# Altium schematic sheet Controller.SchDoc
size C; SheetNumber: 2; SheetTotal: 2
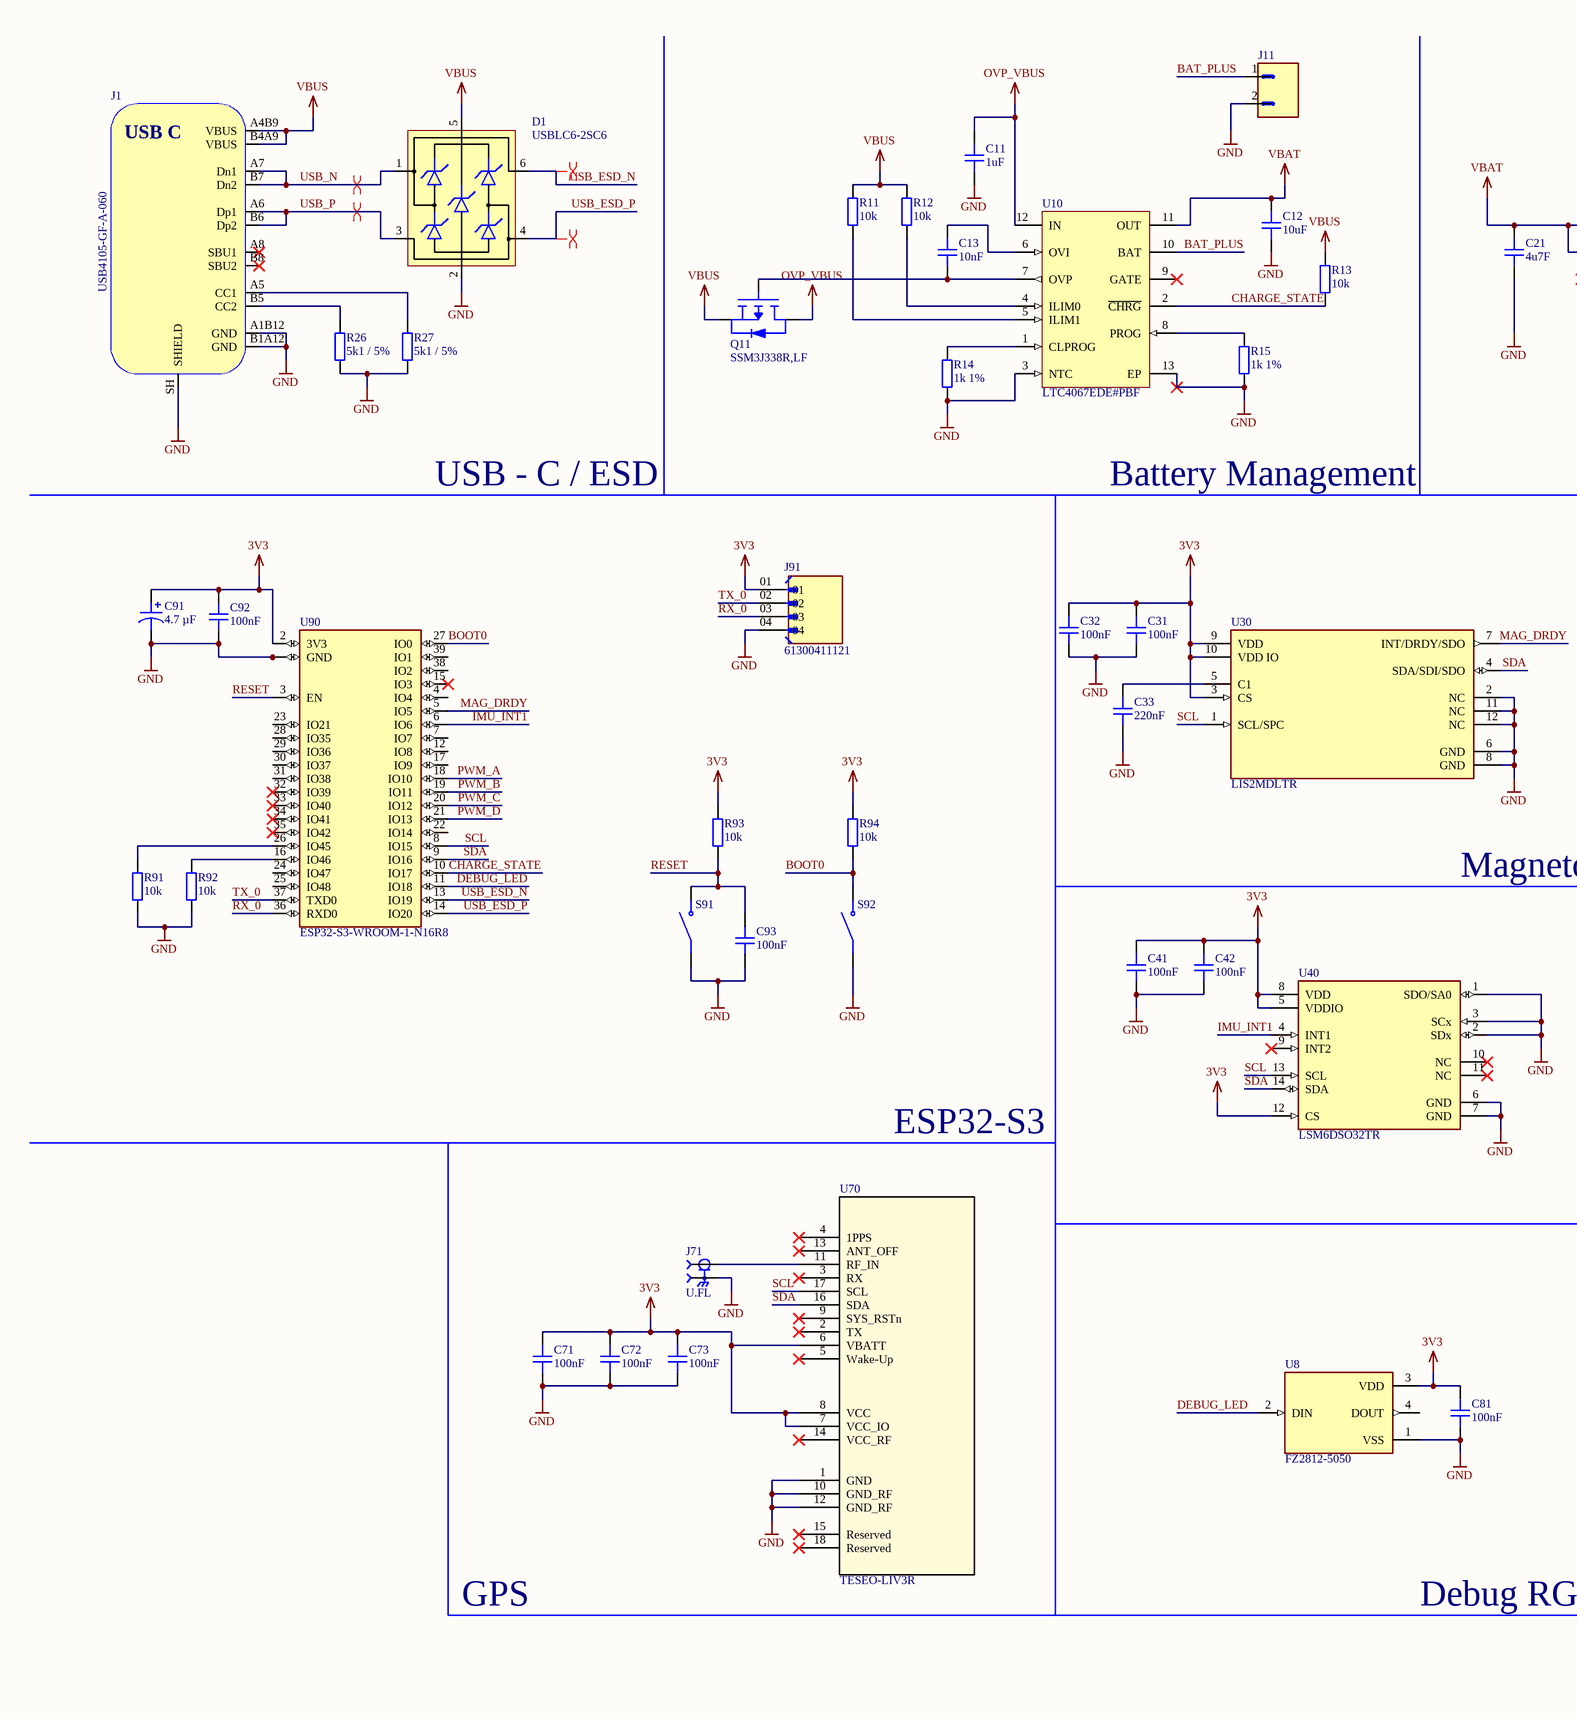
[diagram p0: Controller.SchDoc, left]
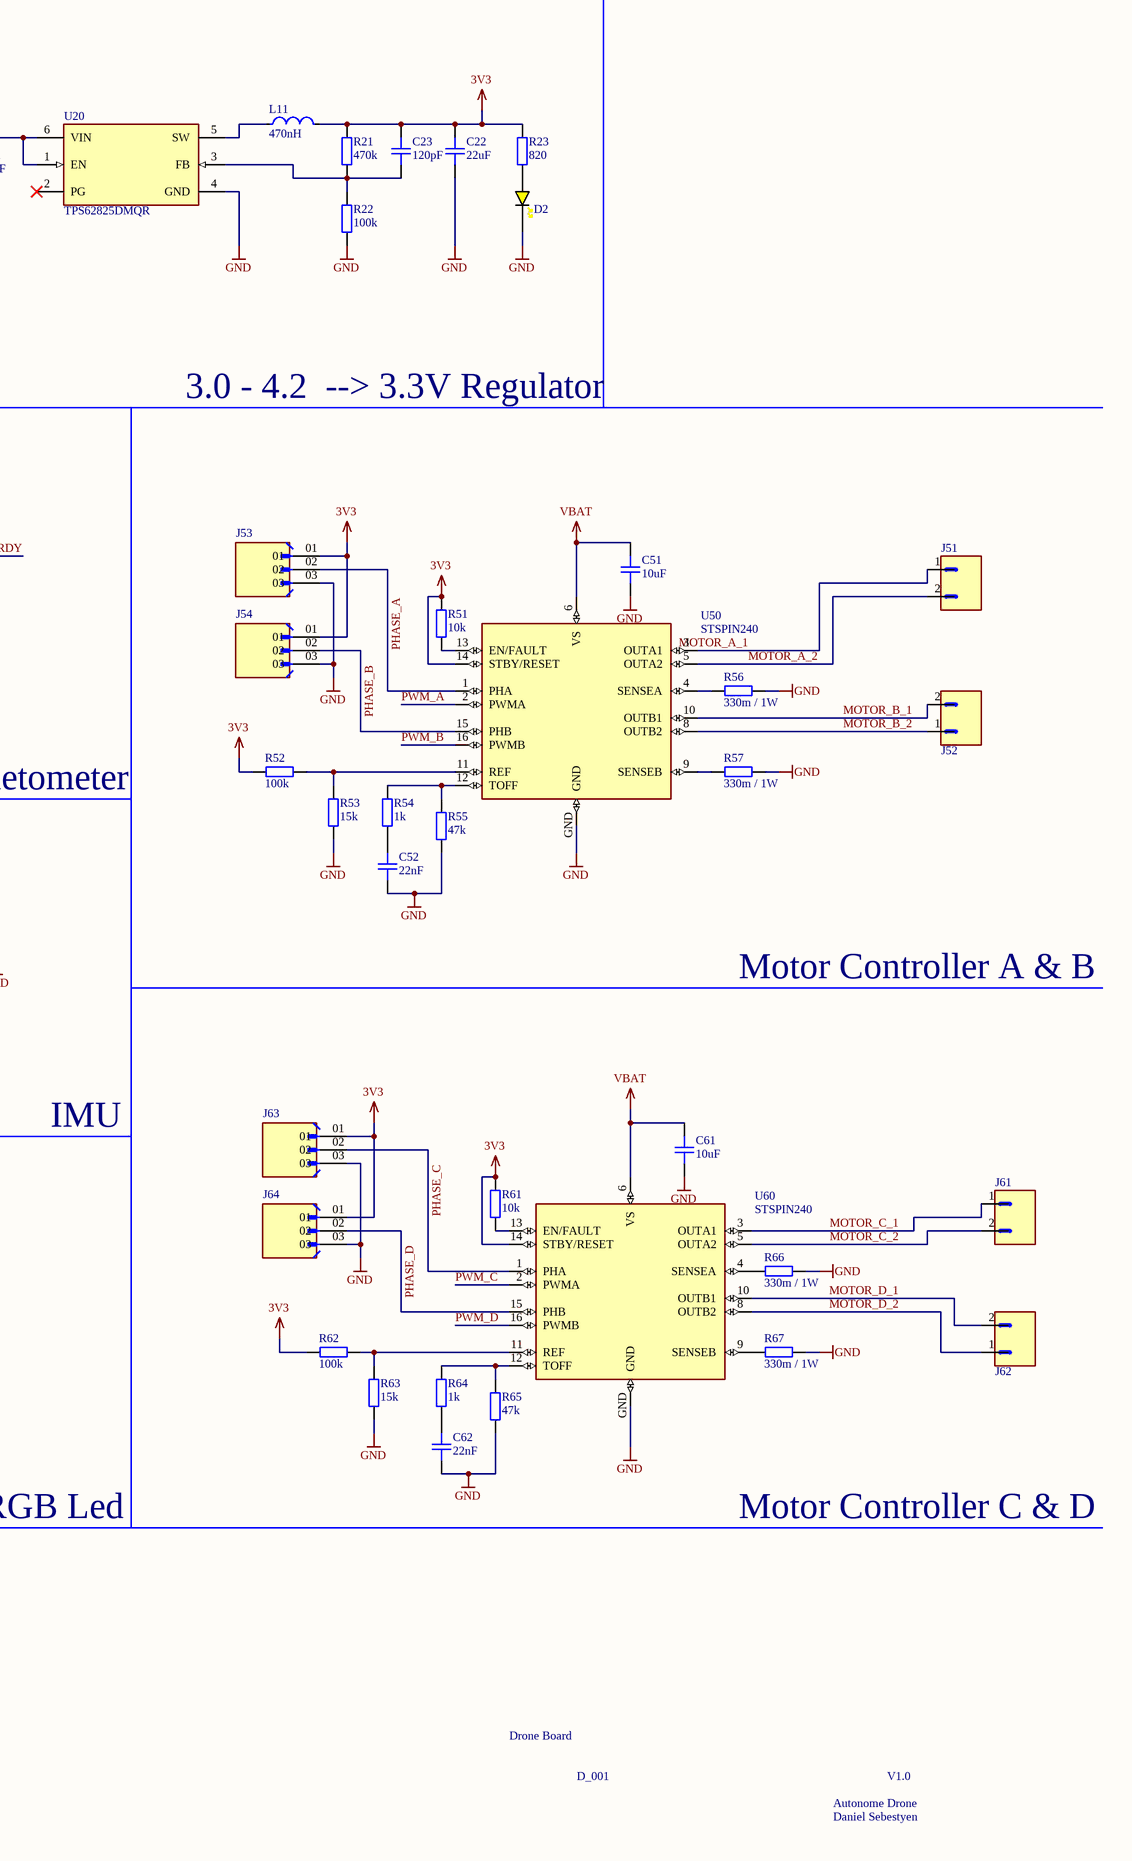
[diagram p1: Controller.SchDoc, right]

## Parts
C11  1uF  [CAP_0201]
C12  10uF  [CAP_0201]
C13  10nF  [CAP_0201]
C21  4u7F  [CAP_0402]
C22  22uF  [CAP_0402]
C23  120pF  [CAP_0402]
C31  100nF  [CAP_0201]
C32  100nF  [CAP_0201]
C33  220nF  [CAP_0201]
C41  100nF  [CAP_0201]
C42  100nF  [CAP_0201]
C51  10uF  [CAP_0201]
C52  22nF  [CAP_0201]
C61  10uF  [CAP_0201]
C62  22nF  [CAP_0201]
C71  100nF  [CAP_0201]
C72  100nF  [CAP_0201]
C73  100nF  [CAP_0201]
C81  100nF  [CAP_0201]
C91  4.7 µF  [CAP ALSMD 4.3MM H5.4MM]
C92  100nF  [CAP_0201]
C93  100nF  [CAP_0201]
D1  USBLC6-2SC6  [SOT-23-6]
D2  1.8V  [LED_0402_YELLOW]  (value not drawn)
J1  USB4105-GF-A-060  [USB4105-GF-A-060]
J11  S2B-PH-SM4-TB(LF)(SN)  [S2B-PH-SM4-TB(LF)(SN)]  (value not drawn)
J51  S2B-PH-SM4-TB(LF)(SN)  [S2B-PH-SM4-TB(LF)(SN)]  (value not drawn)
J52  S2B-PH-SM4-TB(LF)(SN)  [S2B-PH-SM4-TB(LF)(SN)]  (value not drawn)
J53  61300311121  [WURTH_61300311121]  (value not drawn)
J54  61300311121  [WURTH_61300311121]  (value not drawn)
J61  S2B-PH-SM4-TB(LF)(SN)  [S2B-PH-SM4-TB(LF)(SN)]  (value not drawn)
J62  S2B-PH-SM4-TB(LF)(SN)  [S2B-PH-SM4-TB(LF)(SN)]  (value not drawn)
J63  61300311121  [WURTH_61300311121]  (value not drawn)
J64  61300311121  [WURTH_61300311121]  (value not drawn)
J71  U.FL  [MOLEX_73412-0114]
J91  61300411121  [WURTH_61300411121]
L11  470nH  [FP-DFE201610C-MFG]
Q11  SSM3J338R,LF  [SSM3J338R,LF-SOT23-F]
R11  10k  [RES_0201]
R12  10k  [RES_0201]
R13  10k  [RES_0201]
R14  1k 1%  [RES_0201]
R15  1k 1%  [RES_0201]
R21  470k  [RES_0402]
R22  100k  [RES_0402]
R23  820  [RES_0402]
R26  5k1 / 5%  [RES_0201]
R27  5k1 / 5%  [RES_0201]
R51  10k  [RES_0201]
R52  100k  [RES_0201]
R53  15k  [RES_0201]
R54  1k  [RES_0201]
R55  47k  [RES_0201]
R56  330m / 1W  [RES_0201]
R57  330m / 1W  [RES_0201]
R61  10k  [RES_0201]
R62  100k  [RES_0201]
R63  15k  [RES_0201]
R64  1k  [RES_0201]
R65  47k  [RES_0201]
R66  330m / 1W  [RES_0201]
R67  330m / 1W  [RES_0201]
R91  10k  [RES_0201]
R92  10k  [RES_0201]
R93  10k  [RES_0201]
R94  10k  [RES_0201]
S91  PTS636_SM43J_SMTR_LFS  [SW_PTS636_SM43J_SMTR_LFS]  (value not drawn)
S92  PTS636_SM43J_SMTR_LFS  [SW_PTS636_SM43J_SMTR_LFS]  (value not drawn)
U8  FZ2812-5050  [LED_FZ2812-5050]
U10  LTC4067EDE#PBF  [LT-DE-UE-12_V]
U20  TPS62825DMQR  [FP-DMQ0006A-MFG]
U30  LIS2MDLTR  [FP-LGA-12-DM00170568-MFG]
U40  LSM6DSO32TR  [FP-LGA-14L-DM00249496-MFG]
U50  STSPIN240  [VFQFPN_3X3X1MM]
U60  STSPIN240  [VFQFPN_3X3X1MM]
U70  TESEO-LIV3R  [ARRAY_LIV3R_STM]
U90  ESP32-S3-WROOM-1-N16R8  [ESP32S3WROOM1N8R2]

## Nets
3V3: C22.2 C23.2 C31.2 C32.2 C41.2 C42.2 C71.2 C72.2 C73.2 C81.2 C91.1 C92.2 J53.01 J54.01 J63.01 J64.01 J91.01 L11.2 R21.2 R23.2 R51.1 R52.2 R61.1 R62.2 R93.2 R94.2 U8.3(VDD) U30.3(CS) U30.9(VDD) U30.10(VDD_IO) U40.5(VDDIO) U40.8(VDD) U40.12(CS) U50.14(STBY/RESET) U60.14(STBY/RESET) U70.6(VBATT) U70.7(VCC_IO) U70.8(VCC) U90.2(3V3)
GND: C11.1 C12.1 C21.1 C22.1 C31.1 C32.1 C33.1 C41.1 C42.1 C51.1 C52.1 C61.1 C62.1 C71.1 C72.1 C73.1 C81.1 C91.2 C92.1 C93.1 D1.2(GND) D2.K J1.A1B12(GND) J1.B1A12(GND) J1.SH(SHIELD) J11.2 J53.03 J54.03 J63.03 J64.03 J71.GND J91.04 R14.1 R15.1 R22.1 R26.1 R27.1 R53.2 R55.2 R56.1 R57.1 R63.2 R65.2 R66.1 R67.1 R91.1 R92.1 S91.1(COM) S92.1(COM) U8.1(VSS) U10.3(NTC) U10.13(EP) U20.4(GND) U30.2(NC) U30.6(GND) U30.8(GND) U30.11(NC) U30.12(NC) U40.1(SDO/SA0) U40.2(SDx) U40.3(SCx) U40.6(GND) U40.7(GND) U50.GND U60.GND U70.1(GND) U70.10(GND_RF) U70.12(GND_RF) U90.1(GND) U90.40(GND) U90.41(GND) U90.42(GND) U90.43(GND) U90.44(GND) U90.45(GND) U90.46(GND) U90.47(GND) U90.48(GND) U90.49(GND)
OVP_VBUS: C11.2 Q11.D U10.12(IN)
VBAT: C12.2 C21.2 C51.2 C61.2 U10.11(OUT) U20.1(EN) U20.6(VIN) U50.6(VS) U60.6(VS)
VBUS: D1.5(VBUS) J1.A4B9(VBUS) J1.B4A9(VBUS) Q11.S R11.2 R12.2 R13.2
BAT_PLUS: J11.1 U10.10(BAT)
BOOT0: R94.1 S92.2(NO) U90.27(IO0)
CHARGE_STATE: R13.1 U10.2(~{CHRG}) U90.10(IO17)
DEBUG_LED: U8.2(DIN) U90.11(IO18)
IMU_INT1: U40.4(INT1) U90.6(IO6)
MAG_DRDY: U30.7(INT/DRDY/SDO) U90.5(IO5)
MOTOR_A_1: J51.1 U50.3(OUTA1)
MOTOR_A_2: J51.2 U50.5(OUTA2)
MOTOR_B_1: J52.2 U50.10(OUTB1)
MOTOR_B_2: J52.1 U50.8(OUTB2)
MOTOR_C_1: J61.1 U60.3(OUTA1)
MOTOR_C_2: J61.2 U60.5(OUTA2)
MOTOR_D_1: J62.2 U60.10(OUTB1)
MOTOR_D_2: J62.1 U60.8(OUTB2)
PHASE_A: J53.02 U50.1(PHA)
PHASE_B: J54.02 U50.15(PHB)
PHASE_C: J63.02 U60.1(PHA)
PHASE_D: J64.02 U60.15(PHB)
PWM_A: U50.2(PWMA) U90.18(IO10)
PWM_B: U50.16(PWMB) U90.19(IO11)
PWM_C: U60.2(PWMA) U90.20(IO12)
PWM_D: U60.16(PWMB) U90.21(IO13)
RESET: C93.2 R93.1 S91.2(NO) U90.3(EN)
RX_0: J91.03 U90.36(RXD0)
SCL: U30.1(SCL/SPC) U40.13(SCL) U70.17(SCL) U90.8(IO15)
SDA: U30.4(SDA/SDI/SDO) U40.14(SDA) U70.16(SDA) U90.9(IO16)
TX_0: J91.02 U90.37(TXD0)
USB_ESD_N: D1.6(IO1) U90.13(IO19)
USB_ESD_P: D1.4(IO2) U90.14(IO20)
USB_N: D1.1(IO1) J1.A7(Dn1) J1.B7(Dn2)
USB_P: D1.3(IO2) J1.A6(Dp1) J1.B6(Dp2)
NetC13_1: C13.1 Q11.G U10.7(OVP)
NetC13_2: C13.2 U10.6(OVI)
NetC23_1: C23.1 R21.1 R22.2 U20.3(FB)
NetC33_2: C33.2 U30.5(C1)
NetC52_2: C52.2 R54.2
NetC62_2: C62.2 R64.2
NetD2_A: D2.A R23.1
NetJ1_A5: J1.A5(CC1) R27.2
NetJ1_B5: J1.B5(CC2) R26.2
NetJ71_1: J71.1(SIG) U70.11(RF_IN)
NetL11_1: L11.1 U20.5(SW)
NetR11_1: R11.1 U10.5(ILIM1)
NetR12_1: R12.1 U10.4(ILIM0)
NetR14_2: R14.2 U10.1(CLPROG)
NetR15_2: R15.2 U10.8(PROG)
NetR51_2: R51.2 U50.13(EN/FAULT)
NetR52_1: R52.1 R53.1 U50.11(REF)
NetR54_1: R54.1 R55.1 U50.12(TOFF)
NetR56_2: R56.2 U50.4(SENSEA)
NetR57_2: R57.2 U50.9(SENSEB)
NetR61_2: R61.2 U60.13(EN/FAULT)
NetR62_1: R62.1 R63.1 U60.11(REF)
NetR64_1: R64.1 R65.1 U60.12(TOFF)
NetR66_2: R66.2 U60.4(SENSEA)
NetR67_2: R67.2 U60.9(SENSEB)
NetR91_2: R91.2 U90.26(IO45)
NetR92_2: R92.2 U90.16(IO46)

Not connected (* = marked no-connect by the designer): J1 A8(SBU1)* B8(SBU2)*; U8 4(DOUT); U10 9(GATE)*; U20 2(PG)*; U40 9(INT2)* 10(NC)* 11(NC)*; U70 2(TX)* 3(RX)* 4(1PPS)* 5(Wake-Up)* 9(SYS_RSTn)* 13(ANT_OFF)* 14(VCC_RF)* 15(Reserved)* 18(Reserved)*; U90 4(IO4) 7(IO7) 12(IO8) 15(IO3)* 17(IO9) 22(IO14) 23(IO21) 24(IO47) 25(IO48) 28(IO35) 29(IO36) 30(IO37) 31(IO38) 32(IO39)* 33(IO40)* 34(IO41)* 35(IO42)* 38(IO2) 39(IO1)

## Layout directives
differential pair: USB_ESD_N, USB_ESD_P, USB_N, USB_P

## Notes on the sheet
- USB - C / ESD
- Battery Management
- 3.0 - 4.2  --> 3.3V Regulator
- Magnetometer
- Motor Controller A & B
- ESP32-S3
- IMU
- GPS
- Debug RGB Led
- Motor Controller C & D
- Drone Board
- D_001
- Daniel Sebestyen
- Autonome Drone
- V1.0
- (in symbol USB4105-GF-A-060) USB C

## Library data of the parts
C11-C13 C31-C33 C41 C42 C51 C52 C61 C62 C71-C73 C81 C92 C93 = CAP_0402: Capacitor SMD 0402; Manufacturer: *; Manufacturer Part Number: *; Distributor Link: *; LCSC: *; Rating: *; Dielectric: *
C21-C23 = CAP_0603: Capacitor SMD 0603; Manufacturer: *; Manufacturer Part Number: *; Distributor Link: *; LCSC: *; Rating: *; Dielectric: *
C91 = EEE-1CA4R7NR: CAP ALUM 4.7UF 20% 16V SMD; manufacturer: Panasonic Electronic Components; Lifetime @ Temp.: 2000 Hrs @ 85°C; Polarization: Polar; Ripple Current @ High Frequency: 34 mA @ 10 kHz; Ripple Current @ Low Frequency: 20 mA @ 120 Hz; Surface Mount Land Size: 0.169" L x 0.169" W (4.30mm x 4.30mm); Part Number: EEE-1CA4R7NR; Applications: Automotive; Capacitance: 4.7 µF; componentlink1description: Datasheet; componentlink1url: //media.digikey.com/pdf/Data%20Sheets/Panasonic%20Electronic%20Components/S_Series,Type_V_Rev2018.pdf; componentlink2description: DigiKey Link; componentlink2url: https://www.digikey.com/en/products/detail/panasonic-electronic-components/EEE-1CA4R7NR/946205; Device Package: Radial, Can - SMD; Height - Seated (Max): 0.217" (5.50mm); lastupdated: 6/3/2024 19:52:58; Lifecycle Status: Active; Minimum Order: 1; Mounting Type: Surface Mount; Operating Temperature: -40°C ~ 85°C; Package / Case: Radial, Can - SMD; packaging: TapeAndReel; partid: 7087; Part Status: Active; price: 0.07; Ratings: AEC-Q200; series: S; Size / Dimension: 0.157" Dia (4.00mm); Supplier 1: DigiKey; Supplier Part Number 1: PCE4290CT-ND; Tolerance: ±20%; value: 4.7 µF; Voltage - Rated: 16 V
D1 = USBLC6-2SC6: Low-Capacitance ESD Protection USB; Manufacturer: STMicroelectronics; Manufacturer Part Number: USBLC6-2SC6; Distributor Link: https://www.mouser.de/ProductDetail/STMicroelectronics/USBLC6-2SC6?qs=po45yt2pPpu%2FhNIlwQdTlg%3D%3D
D2 = LED_0603_YELLOW: LED 0603 YELLOW SMD
J1 = USB4105-GF-A-060: USB Connector Type C SMT 12 Pin; Manufacturer: GCT; Manufacturer Part Number: USB4105-GF-A-060; Distributor Link: https://eu.mouser.com/ProductDetail/GCT/USB4105-GF-A-060?qs=QNEnbhJQKvY2mocwNJzgfA%3D%3D
J11 J51 J52 J61 J62 = S2B-PH-SM4-TB(LF)(SN): Connector Header Surface Mount, Right Angle 2 position 0.079 (2.00mm); MF: JST Sales; SnapEDA_Link: https://www.snapeda.com/parts/S2B-PH-SM4-TB(LF)(SN)/JST+Sales+America+Inc./view-part/?ref=snap; Package: None; Value: *; MP: S2B-PH-SM4-TB(LF)(SN); Check_prices: https://www.snapeda.com/parts/S2B-PH-SM4-TB(LF)(SN)/JST+Sales+America+Inc./view-part/?ref=eda
J53 J54 J63 J64 = 61300311121: Connector Header Through Hole 3 position 0.100 (2.54mm); MF: Wurth Electronics; SnapEDA_Link: https://www.snapeda.com/parts/61300311121/Wurth+Electronics/view-part/?ref=snap; Package: None; Value: *; MP: 61300311121; Check_prices: https://www.snapeda.com/parts/61300311121/Wurth+Electronics/view-part/?ref=eda
J71 = 73412-0114: Female Surface Mount Coaxial Socket, Solder Termination | Molex Incorporated 73412-0114; SnapEDA_Link: https://www.snapeda.com/parts/73412-0114/Molex/view-part/?ref=snap; Package: None; Value: *; MF: Molex; MP: 73412-0114; Check_prices: https://www.snapeda.com/parts/73412-0114/Molex/view-part/?ref=eda
J91 = 61300411121: 4 pins, 1 row, straight, gold plating; MF: Wurth Electronics; SnapEDA_Link: https://www.snapeda.com/parts/61300411121/Wurth+Electronics/view-part/?ref=snap; Package: None; Value: *; MP: 61300411121; Check_prices: https://www.snapeda.com/parts/61300411121/Wurth+Electronics/view-part/?ref=eda
L11 = CMP-06042-011901-1: Shielded Wirewound Inductor 0.47uH 20% 3600mA 0.032Ω 0806 (2016)
Q11 = SSM3J338R,LF: MOSFET P-Channel Vds=12V Id=6A; Manufacturer Part Number: Toshiba; Manufacturer: SSM3J338R,LF
R11-R15 R26 R27 R51-R57 R61-R67 R91-R94 = RES_0402: Resistor SMD 0402; Manufacturer: *; Manufacturer Part Number: *; Distributor Link: *; LCSC: *
R21-R23 = RES_0603: Resistor SMD 0603; Manufacturer: *; Manufacturer Part Number: *; Distributor Link: *; LCSC: *
S91 S92 = PTS636_SM43J_SMTR_LFS: Tactile Switch SPST-NO Top Actuated Surface Mount; MF: C&K; MP: PTS636 SM43J SMTR LFS; SnapEDA_Link: https://www.snapeda.com/parts/PTS636%20SM43J%20SMTR%20LFS/C%2526K/view-part/?ref=snap; Package: None; Value: *; Check_prices: https://www.snapeda.com/parts/PTS636%20SM43J%20SMTR%20LFS/C%2526K/view-part/?ref=eda
U8 = FZ2812-5050: Addressable Lighting * 3 LED Discrete Serial Red, Green, Blue (RGB) 5.00mm L x 5.00mm W; MF: Feztek; Package: None; Price: None; Check_prices: https://www.snapeda.com/parts/FZ2812-5050/E%2526E/view-part/?ref=eda; Value: *; SnapEDA_Link: https://www.snapeda.com/parts/FZ2812-5050/E%2526E/view-part/?ref=snap; MP: FZ2812-5050; Availability: In Stock; Purchase-URL: https://pricing.snapeda.com/search?q=FZ2812-5050&ref=eda
U10 = CMP-0478-00072-1: USB Power Manager with OVP and Li-Ion / Polymer Charger, 4.35 to 5.5 V Vin, 12-pin SON (DE-UE-12), -40 to 85 degC, Pb-Free; Manufacturer: Linear Technology; Number of Cells: 1; PartNumber: LTC4067EDE#PBF; ComponentLink3Description: Package Specification; ComponentLink1Description: Manufacturer URL; Mounting Technology: Surface Mount; Code_JEDEC: MO-229; PackageDescription: 12-Pin Plastic DFN, Body 4 x 3 mm, Pitch 0.5 mm; RoHS: TRUE; Number of Outputs: 1; ComponentLink2Description: Datasheet; ComponentLink1URL: http://www.linear.com/; ComponentLink3URL: http://cds.linear.com/docs/en/packaging/DFN_12_05-08-1695.pdf; PackageReference: DE-UE-12; PackageVersion: Rev. D, 06/2010; ComponentLink2URL: http://cds.linear.com/docs/en/datasheet/4067f.pdf
U20 = CMP-04918-000438-1: IC REG BUCK ADJUSTABLE 2A 6VSON; Max Input Voltage: 5.5V; Number of Outputs: 1; Min Output Voltage: 600mV; Switching Frequency: 2.2MHz; Synchronous Rectifier: Yes; Max Output Voltage: 4V; Min Input Voltage: 2.4V; Output Configuration: Positive; Max Operating Temperature: 125°C; Output Type: Adjustable; Output Current: 2A; Mount: Surface Mount; Min Operating Temperature: -40°C; Number of Pins: 6; RoHS Compliant: Yes; Packaging: Tape and Reel
U30 = CMP-12173-000002-1: SENSOR MR I2C/SPI 12LGA; Manufacturer: STMicroelectronics; Sensing Method: Magnetic; Min Supply Voltage: 1.71V; Sensor Output: I2C,SPI; Operating Supply Current: 50-200uA; Max Supply Voltage: 3.6V; Octopart: https://octopart.com/lis2mdltr-stmicroelectronics-81117311; RoHS: TRUE; Device Class L3: unset; Device Class L1: Sensors; ComponentLink2URL: https://www.st.com/resource/en/datasheet/lis2mdl.pdf; Automotive: No; Device Class L2: Magnetic Sensors; Lead Free: Yes; Temperature: -40°C to +85°C; Manufacturer Part Number: LIS2MDLTR; Temperature Range High: +85°C; Height: 0.7mm; Digikey Description: SENSOR MR I2C/SPI 12LGA; Category: IC; ComponentLink2Description: Datasheet; Package: LGA-12-DM00170568; Temperature Range Low: -40°C
U40 = CMP-12177-000015-1: INEMO INERTIAL MODULE: 3D ACCELE
U50 U60 = STSPIN240: Half Bridge (4) Driver DC Motors, General Purpose Power MOSFET 16-VFQFPN (3x3); MF: STMicroelectronics; SnapEDA_Link: https://www.snapeda.com/parts/STSPIN240/STMicroelectronics/view-part/?ref=snap; Package: VFQFN-16 STMicroelectronics; Value: *; MP: STSPIN240; Check_prices: https://www.snapeda.com/parts/STSPIN240/STMicroelectronics/view-part/?ref=eda
U70 = TESEO-LIV3R: No Description Available; Mfr_Name: STMicroelectronics; RefDes: RefDes; Type: Type
U90 = ESP32-S3-WROOM-1-N16R8: Bluetooth, WiFi 802.11b/g/n, Bluetooth v5.0 Transceiver Module 2.4GHz PCB Trace Surface Mount; MF: Espressif Systems; SnapEDA_Link: https://www.snapeda.com/parts/ESP32-S3-WROOM-1-N16R8/Espressif+Systems/view-part/?ref=snap; Package: NON STANDARD Espressif Systems; Value: *; MP: ESP32-S3-WROOM-1-N16R8; Check_prices: https://www.snapeda.com/parts/ESP32-S3-WROOM-1-N16R8/Espressif+Systems/view-part/?ref=eda